# Altium schematic sheet DE-180417_03.SchDoc: Sensor Board
size A4; Author: eldar6776@hotmail.com; DrawnBy: Eldar DEdić; Organization: I-MEDIA GROUP d.o.o.; Address1: Topal Osman Paše 18; Address2: 71000 Sarajevo; Address3: Federacija BiH; Address4: Bosna i Hercegovina; DocumentNumber: 3; Revision: 001; SheetNumber: 3; SheetTotal: 3; ProjectName: Prekidač Balkonske Rasvjete
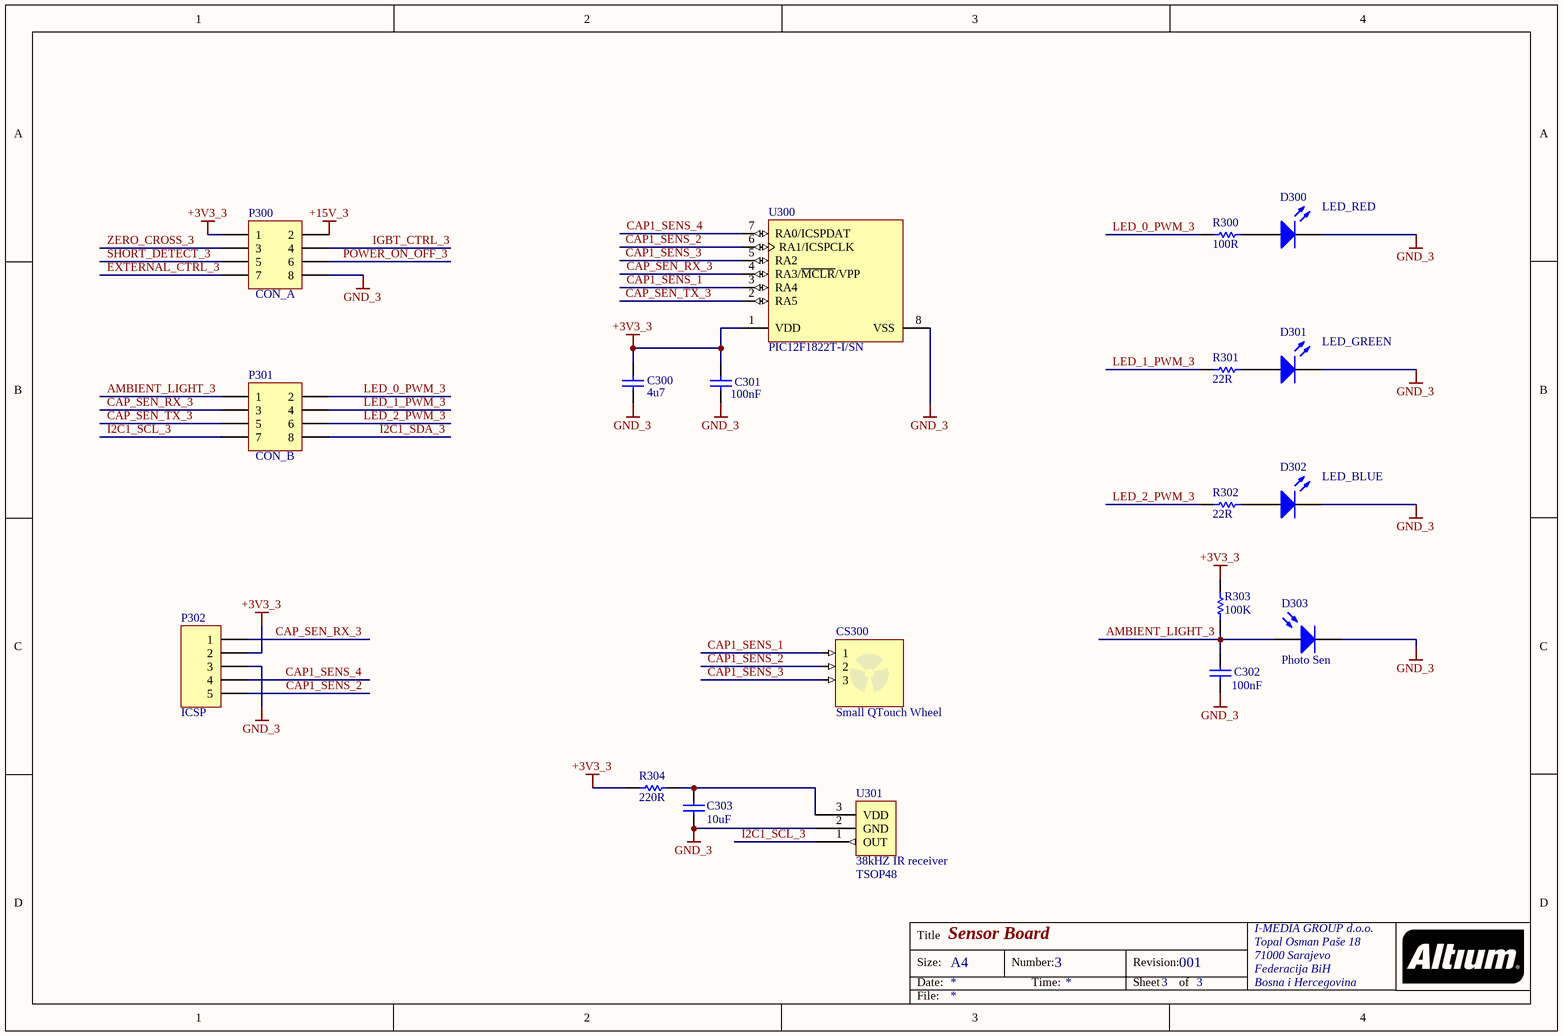
[diagram p0: DE-180417_03.SchDoc]

## Parts
C300  4u7  [0805]
C301  100nF  [0603]
C302  100nF  [0603]
C303  10uF  [0805]
CS300  Small QTouch Wheel  (no BOM)
D300  LED_RED  [1.6X0.8X0.8]
D301  LED_GREEN  [1.6X0.8X0.8]
D302  LED_BLUE  [1.6X0.8X0.8]
D303  Photo Sen  [PIN2]
P300  CON_A  [HDR2X4]
P301  CON_B  [HDR2X4]
P302  ICSP  [HDR1X5]
R300  100R  [ERA-0603]
R301  22R  [ERA-0603]
R302  22R  [ERA-0603]
R303  100K  [ERA-0603]
R304  220R  [ERA-0603]
U300  PIC12F1822T-I/SN  [MCHP-SOIC-SN8_N]
U301  38kHZ IR receiver  value TSOP48  [TSOP48]

## Nets
+3V3_3: C300.1 C301.1 P300.1 P302.2 R303.1 R304.1 U300.1(VDD)
+15V_3: P300.2
GND_3: C300.2 C301.2 C302.2 C303.2 D300.2(K) D301.2(K) D302.2(K) D303.2(K) P300.8 P302.3 U300.8(VSS) U301.2(GND)
AMBIENT_LIGHT_3: C302.1 D303.1(A) P301.1 R303.2
CAP1_SENS_1: CS300.1 U300.3(RA4)
CAP1_SENS_2: CS300.2 P302.5 U300.6(RA1/ICSPCLK)
CAP1_SENS_3: CS300.3 U300.5(RA2)
CAP1_SENS_4: P302.4 U300.7(RA0/ICSPDAT)
CAP_SEN_RX_3: P301.3 P302.1 U300.4(RA3/~{MCLR}/VPP)
CAP_SEN_TX_3: P301.5 U300.2(RA5)
EXTERNAL_CTRL_3: P300.7
I2C1_SCL_3: P301.7 U301.1(OUT)
I2C1_SDA_3: P301.8
IGBT_CTRL_3: P300.4
LED_0_PWM_3: P301.2 R300.2
LED_1_PWM_3: P301.4 R301.2
LED_2_PWM_3: P301.6 R302.2
POWER_ON_OFF_3: P300.6
SHORT_DETECT_3: P300.5
ZERO_CROSS_3: P300.3
NetC303_1: C303.1 R304.2 U301.3(VDD)
NetD300_1: D300.1(A) R300.1
NetD301_1: D301.1(A) R301.1
NetD302_1: D302.1(A) R302.1

## Notes on the sheet
- Title
- Size:
- Date:
- A4
- Number:
- Time:
- Revision:
- Sheet
- of
- File:

## Library data of the parts
C300 C303 = C0805: Ceramic Chip Capacitor - Standard; Note: Footprint corresponds to dimensions for bulk cassette packaging. This case size has tightened tolerances.; Published: 17-Jul-2002; LatestRevisionDate: 19-Mar-2004; LatestRevisionNote: Silkscreen size reduced.; DatasheetDocument: Mar-2001; PackageDocument: Mar-2001; PackageReference: 0805; Publisher: Altium Limited; Code_JEITA: 0805; Code_IPC: 2012[0805]; ComponentLink1Description: Manufacturer Link; ComponentLink1URL: http://www.kemet.com/; ComponentLink2Description: Datasheet; ComponentLink2URL: http://www.kemet.com/kemet/web/homepage/kechome.nsf/vapubfilesname/F3102TA.pdf/$file/F3102TA.pdf
  C300: Value: 4u7
C301 C302 = C0603: Ceramic Chip Capacitor - Standard; Note: Footprint corresponds to dimensions for bulk cassette packaging. This case size has tightened tolerances.; Published: 17-Jul-2002; LatestRevisionDate: 19-Mar-2004; LatestRevisionNote: Silkscreen size reduced.; DatasheetDocument: Mar-2001; PackageDocument: Mar-2001; PackageReference: 0603; Publisher: Altium Limited; Code_JEITA: 0603; Code_IPC: 1608 [0603]; ComponentLink1Description: Manufacturer Link; ComponentLink1URL: http://www.kemet.com/; ComponentLink2Description: Datasheet; ComponentLink2URL: http://www.kemet.com/kemet/web/homepage/kechome.nsf/vapubfilesname/F3102TA.pdf/$file/F3102TA.pdf; Value: 100nF
CS300 = SmallQTouchWheel: ConfiguratorName: ATMEL_TOUCH; ConfigurationParameters: {}__sensorid[7]{}diameter[20]{}
D300-D302 = HSMZ-C190: High Performance Chip LED, Red; LuminousIntensity: 40mcd (Minimum).; PCB_Layout: Complies with manufacturer's recommendation.; Published: 11-Dec-2002; DatasheetDocument: 11-Mar-2002; PackageDocument: 11-Mar-2002; PackageReference: 1.6X0.8X0.8; Publisher: Altium Limited; LED_Colour: Red; ComponentLink1Description: Manufacturer Link; ComponentLink1URL: http://www.agilent.com/; ComponentLink2Description: Datasheet; ComponentLink2URL: http://cp.literature.agilent.com/litweb/pdf/5988-5891EN.pdf
D303 = Photo Sen: Photosensitive Diode; Published: 24-Mar-1999; LatestRevisionDate: 17-Jul-2002; LatestRevisionNote: Re-released for DXP Platform.; PackageReference: PIN2; Publisher: Altium Limited
P300 P301 = Header 4X2: Header, 4-Pin, Dual row; LatestRevisionDate: 17-Jul-2002; LatestRevisionNote: Re-released for DXP Platform.; Publisher: Altium Limited
P302 = Header 5: Header, 5-Pin; LatestRevisionDate: 17-Jul-2002; LatestRevisionNote: Re-released for DXP Platform.; Publisher: Altium Limited
R300-R304 = ERAV: Metal Film Thermosensitive Chip Resistor, 0.56 Ohm to 10k Ohm Range, 5% Tolerance, 0603 Size, 0.063 W; Note: If flow soldering, adjust pad width of PCB Footprint to 0.7 - 0.8 times the width of the resistor.; Published: 17-Dec-2003; LatestRevisionDate: 19-Mar-2004; LatestRevisionNote: Silkscreen size reduced.; PackageDocument: Mar-2003; PackageReference: ERA-0603; Publisher: Altium Limited; Code_IPC: 1608 [0603]; ComponentLink1Description: Manufacturer Link; ComponentLink1URL: http://www.panasonic.com/industrial/components/resistive_products.htm; ComponentLink2Description: Datasheet; ComponentLink2URL: http://www.panasonic.com/industrial/components/pdf/AOF0000CE1.pdf
U300 = PIC12F1822T-I/SN: Flash Microcontroller with XLP Technology, 32 MHz, 5 I/O, -40 to 85 degC, 8-pin SOIC (SN8), Tape and Reel; Manufacturer: Microchip; # of A/D Channels: 4; Digital Communication: 1 -A/E/USART, 1 -MSSP(SPI/I2C); EEPROM Data Memory (bytes): 256; I/O Pins: 5; Internal Oscillator: 32 MHz, 31 kHz; Max. CPU Speed MHz: 32; Operation Voltage Range: 1.8V - 5.5V; Packing: T/R; Program Memory KBytes: 3.5; Program Memory KWords: 2; RAM: 128; Timers: 2 - 8-bit, 1 - 16-bit, 0 - 32-bit; DatasheetVersion: Rev. C; PackageVersion: C04-057C, 12/2012; PackageReference: SOIC-SN8; PackageDescription: 8-Lead Plastic Small Outline, 4.9 x 3.9 mm Body, 1.27 mm Pitch; Supplier 1: Digi-Key; Supplier Part Number 1: PIC12F1822T-I/SN-ND; Supplier 2: Newark; Supplier Part Number 2: 53R0198; Supplier 3: Mouser; Supplier Part Number 3: 579-PIC12F1822T-I/SN; Memory Type: Flash; RoHS: TRUE; Mounting Technology: Surface Mount; PartNumber: PIC12F1822T-I/SN; ComponentLink1Description: Datasheet; ComponentLink1URL: http://ww1.microchip.com/downloads/en/DeviceDoc/41413C.pdf; ComponentLink2Description: Package Specification; ComponentLink2URL: http://www.microchip.com/stellent/groups/techpub_sg/documents/packagingspec/en012702.pdf; ComponentLink3Description: URL Link1; ComponentLink3URL: Product URL:http://www.microchip.com/datasheet/PIC12F1822
U301 = TSOP48